# Altium schematic sheet Extension.SchDoc
size A4; SheetNumber: 1; SheetTotal: 1
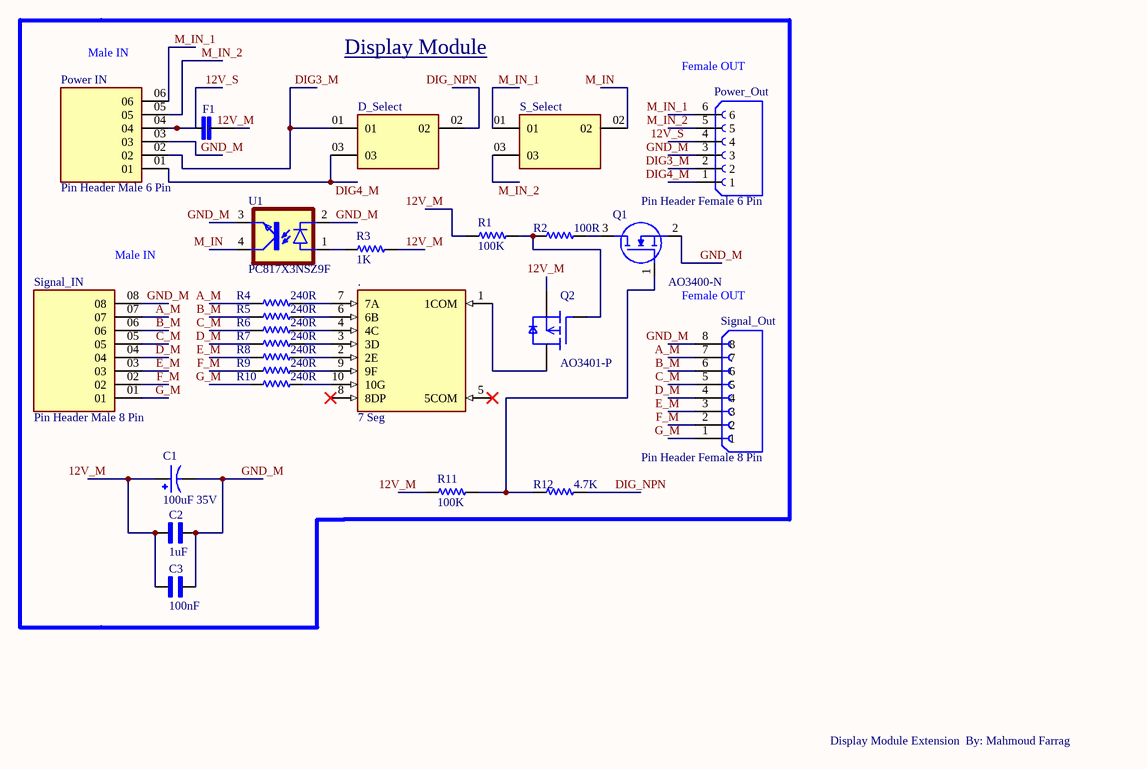
[diagram p0: Extension.SchDoc]

## Parts
.  7 Seg  [2.3_7-SEG_DIS]
C1  100uF 35V  [100uF 35V]
C2  1uF  [Capacitor 0805]
C3  100nF  [Capacitor 0805]
D_Select  Pin Header Male 3 Pin  [3Pin-M-Header_3MX1-254MM]  (value not drawn)
F1  Ferrite Bead 0805  [Ferrite Bead 0805]  (value not drawn)
Power_IN  Pin Header Male 6 Pin  [6Pin-M-Header_6MX1-254MM]
Power_Out  Pin Header Female 6 Pin  [6Pin-F-Header_6FX1-254MM]
Q1  AO3400-N  [AO-3400-N-SOT95]
Q2  AO3401-P  [AO-3401-P-SOT23-3]
R1  100K  [Resistor 1206]
R2  100R  [Resistor 1206]
R3  1K  [Resistor 1206]
R4  240R  [Resistor 1206]
R5  240R  [Resistor 1206]
R6  240R  [Resistor 1206]
R7  240R  [Resistor 1206]
R8  240R  [Resistor 1206]
R9  240R  [Resistor 1206]
R10  240R  [Resistor 1206]
R11  100K  [Resistor 1206]
R12  4.7K  [Resistor 1206]
S_Select  Pin Header Male 3 Pin  [3Pin-M-Header_3MX1-254MM]  (value not drawn)
Signal_IN  Pin Header Male 8 Pin  [8Pin-M-Header_8MX1-254MM]
Signal_Out  Pin Header Female 8 Pin  [8Pin-F-Header_8FX1-254MM]
U1  PC817X3NSZ9F  [PC 817]

## Nets
12V_M: C1.1 C2.1 C3.1 F1.2 Q2.2(S) R1.1 R3.2 R11.1
12V_S: F1.1 Power_IN.04 Power_Out.4
A_M: R4.1 Signal_IN.07 Signal_Out.7
B_M: R5.1 Signal_IN.06 Signal_Out.6
C_M: R6.1 Signal_IN.05 Signal_Out.5
D_M: R7.1 Signal_IN.04 Signal_Out.4
DIG3_M: D_Select.01 Power_IN.02 Power_Out.2
DIG4_M: D_Select.03 Power_IN.01 Power_Out.1
DIG_NPN: D_Select.02 R12.2
E_M: R8.1 Signal_IN.03 Signal_Out.3
F_M: R9.1 Signal_IN.02 Signal_Out.2
G_M: R10.1 Signal_IN.01 Signal_Out.1
GND_M: C1.2 C2.2 C3.2 Power_IN.03 Power_Out.3 Q1.2(S) Signal_IN.08 Signal_Out.8 U1.2(C) U1.3(EMIT)
M_IN: S_Select.02 U1.4(COL)
M_IN_1: Power_IN.06 Power_Out.6 S_Select.01
M_IN_2: Power_IN.05 Power_Out.5 S_Select.03
Net._1: ..1(1COM) Q2.3(D)
Net._2: ..2(2E) R8.2
Net._3: ..3(3D) R7.2
Net._4: ..4(4C) R6.2
Net._6: ..6(6B) R5.2
Net._7: ..7(7A) R4.2
Net._9: ..9(9F) R9.2
Net._10: ..10(10G) R10.2
NetQ1_1: Q1.1(G) R11.2 R12.1
NetQ1_3: Q1.3(D) R2.2
NetQ2_1: Q2.1(G) R1.2 R2.1
NetR3_1: R3.1 U1.1(A)

Not connected (* = marked no-connect by the designer): . 5(5COM)* 8(8DP)*

## Notes on the sheet
- (near Power_IN) Male IN
- Display Module
- (near Power_Out) Female OUT
- (near Signal_IN) Male IN
- Female OUT
- Display Module Extension  By: Mahmoud Farrag

## Library data of the parts
C1 = 100uF 35V: 100ÂµF 35V Aluminum Electrolytic Capacitors Radial, Can - SMD 2000 Hrs @ 85Â°C; MP: EEE-1VA101P; MF: Panasonic Electronic; Package: RADIAL-2 Panasonic; Purchase-URL: https://pricing.snapeda.com/search/part/EEE-1VA101P/?ref=eda; Check_prices: https://www.snapeda.com/parts/EEE-1VA101P/Panasonic%20Electronic%20Components/view-part/293278/?ref=eda; Value: *; Availability: In Stock; Price: None; SnapEDA_Link: https://www.snapeda.com/parts/EEE-1VA101P/Panasonic%20Electronic%20Components/view-part/293278/?ref=snap
C2 C3 = Capacitor 0805: 0.1 ÂµF Â±10% 50V Ceramic Capacitor X7R 0805 (2012 Metric); MF: Murata; MP: GCE21BR71H104KA01L; SnapEDA_Link: https://www.snapeda.com/parts/GCE21BR71H104KA01L/Murata+Electronics+North+America/view-part/?ref=snap; Package: 2012 Murata; Value: *; Check_prices: https://www.snapeda.com/parts/GCE21BR71H104KA01L/Murata+Electronics+North+America/view-part/?ref=eda
D_Select S_Select = Pin Header Male 3 Pin: MP: TSW-101-23-L-T; Package: None; Price: None; Value: *; Availability: Unavailable
F1 = Ferrite Bead 0805: BLM Series 0805 1 kOhm 200 mA 0.45 DCR Surface Mount Ferrite Bead; MF: Murata; MP: BLM21AH102SN1D; SnapEDA_Link: https://www.snapeda.com/parts/BLM21AH102SN1D/Murata/view-part/?ref=snap; Package: 805-2 Murata; Value: *; Check_prices: https://www.snapeda.com/parts/BLM21AH102SN1D/Murata/view-part/?ref=eda
Power_IN = Pin Header Male 6 Pin: MP: MTSW-106-24-G-S-300; Value: *; Availability: Unavailable; Package: None; Price: None
Power_Out = Pin Header Female 6 Pin: 6 Position Total Single Row 2.54 mm Pitch Straight Female Header; MF: Sullins Connector Solutions; MP: PPTC061LFBNRC; SnapEDA_Link: https://www.snapeda.com/parts/PPTC061LFBNRC/Sullins/view-part/?ref=snap; Package: None; Value: *; Check_prices: https://www.snapeda.com/parts/PPTC061LFBNRC/Sullins/view-part/?ref=eda
Q1 = AO3400-N: N-Channel 30 V 5.8A (Ta) 1.4W (Ta) Surface Mount SOT-23-3; MF: Alpha &; MP: AO3400; SnapEDA_Link: https://www.snapeda.com/parts/AO3400/Alpha+%2526+Omega+Semiconductor+Inc./view-part/?ref=snap; Package: SOT-23-3 Alpha &amp; Omega Semiconductor; Value: *; Check_prices: https://www.snapeda.com/parts/AO3400/Alpha+%2526+Omega+Semiconductor+Inc./view-part/?ref=eda
Q2 = AO3401-P: P-Channel 30 V 4A (Ta) 1.4W (Ta) Surface Mount SOT-23-3; MF: Alpha & Omega Semiconductor; MP: AO3401; SnapEDA_Link: https://www.snapeda.com/parts/AO3401/Alpha/view-part/?ref=snap; Package: SOT-23-3 Alpha &amp; Omega Semiconductor; Value: *; Check_prices: https://www.snapeda.com/parts/AO3401/Alpha/view-part/?ref=eda
R1-R12 = Resistor 1206: Fixed Resistor CRGCQ 1206 10K 5%; MF: TE Connectivity; MP: CRGCQ1206J10K; SnapEDA_Link: https://www.snapeda.com/parts/CRGCQ1206J10K/TE+Connectivity/view-part/?ref=snap; Package: 3115 TE Connectivity; Value: *; Check_prices: https://www.snapeda.com/parts/CRGCQ1206J10K/TE+Connectivity/view-part/?ref=eda
Signal_IN = Pin Header Male 8 Pin: MP: HTSW-108-07-G-S-LL; Availability: Unavailable; Value: *; Package: None; Price: None
Signal_Out = Pin Header Female 8 Pin: Headers & Wire Housings 2.54MM 0.1 8-PIN FEMALE HEADER; MP: 8Fx1-254mm; MF: Gravitech; SnapEDA_Link: https://www.snapeda.com/parts/8Fx1-254mm/Gravitech/view-part/?ref=snap; Price: None; Purchase-URL: https://pricing.snapeda.com/search/part/8Fx1-254mm/?ref=eda; Package: None; Availability: In Stock; Check_prices: https://www.snapeda.com/parts/8Fx1-254mm/Gravitech/view-part/?ref=eda; Value: *
U1 = PC817X3NSZ9F: Optoisolator Transistor Output 5000Vrms 1 Channel 4-DIP; MF: Sharp Microelectronics; SnapEDA_Link: https://www.snapeda.com/parts/PC817X3NSZ9F/Sharp+Microelectronics/view-part/?ref=snap; Package: DIP-4 Sharp Microelectronics; Value: *; MP: PC817X3NSZ9F; Check_prices: https://www.snapeda.com/parts/PC817X3NSZ9F/Sharp+Microelectronics/view-part/?ref=eda